# Altium project Visualizacion_PRJ.PrjPCB
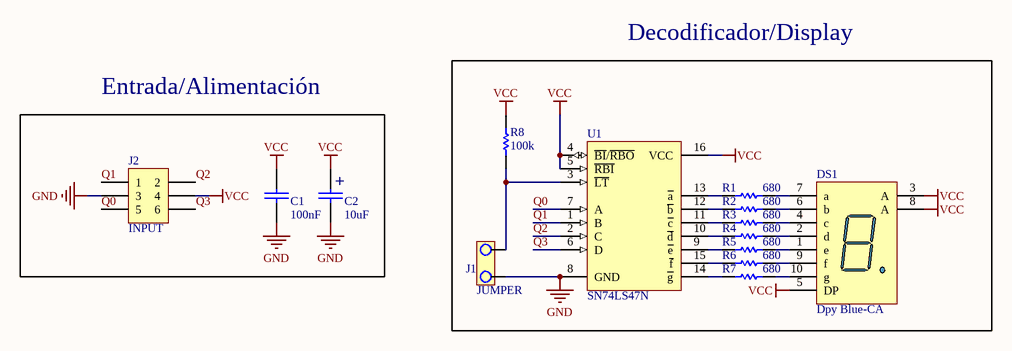
[diagram p0: Visualizacion_SCH.SchDoc]
1 sheet, 14 parts. Net scope: global (net labels, ports and power ports of the same name join across sheets).
Board file: Visualizacion_PCB.PcbDoc

## Sheet Visualizacion_SCH.SchDoc
size A4

### Parts
C1  100nF  [0805]
C2  10uF  [CAP100RP]
DS1  Dpy Blue-CA  [H]
J1  JUMPER  [JUMPER2]
J2  INPUT  [SIP3*2]
R1  680  [0805]
R2  680  [0805]
R3  680  [0805]
R4  680  [0805]
R5  680  [0805]
R6  680  [0805]
R7  680  [0805]
R8  100k  [0805]
U1  SN74LS47N  [DIP16]

### Blocks framed on the sheet
Decodificador/Display: DS1 J1 R1-R8 U1
Entrada/Alimentación: C1 C2 J2

### Nets
GND: C1.2 C2.2 J1.2 J2.3 U1.8(GND)
VCC: C1.1 C2.1 DS1.3(A) DS1.5(DP) DS1.8(A) J2.4 R8.2 U1.4(~{BI}/~{RBO}) U1.5(~{RBI}) U1.16(VCC)
Q0: J2.5 U1.7(A)
Q1: J2.1 U1.1(B)
Q2: J2.2 U1.2(C)
Q3: J2.6 U1.6(D)
NetDS1_1: DS1.1(e) R5.2
NetDS1_2: DS1.2(d) R4.2
NetDS1_4: DS1.4(c) R3.2
NetDS1_6: DS1.6(b) R2.2
NetDS1_7: DS1.7(a) R1.2
NetDS1_9: DS1.9(f) R6.2
NetDS1_10: DS1.10(g) R7.2
NetJ1_1: J1.1 R8.1 U1.3(~{LT})
NetR1_1: R1.1 U1.13(~{a})
NetR2_1: R2.1 U1.12(~{b})
NetR3_1: R3.1 U1.11(~{c})
NetR4_1: R4.1 U1.10(~{d})
NetR5_1: R5.1 U1.9(~{e})
NetR6_1: R6.1 U1.15(~{f})
NetR7_1: R7.1 U1.14(~{g})

### Notes on the sheet
- (in symbol CAPPOL) +

### Library data of the parts
C1 = CAP: Value: 100nF; Footprint: SMD 0805
C2 = CAPPOL: Value: 10uF; Footprint: THT
DS1 = Dpy Blue-CA: 14.2 mm General Purpose Blue 7-Segment Display: CA, RH DP, Gray Surface; Value: Display 7 Segmentos Blue; Footprint: THT
J2 = CON3*2: Value: Pines Macho; Footprint: Pines Macho
R1-R8 = RES: Footprint: SMD 0805
  R1-R7: Value: 680
  R8: Value: 100k
U1 = SN74LS47N: BCD-to-Seven-Segment Decoder/Driver; Value: 74LS47; Footprint: THT DIP16
J1 = JUMPER: Value: Jumper; Footprint: Pines Macho